# Altium project pad.PrjPCB
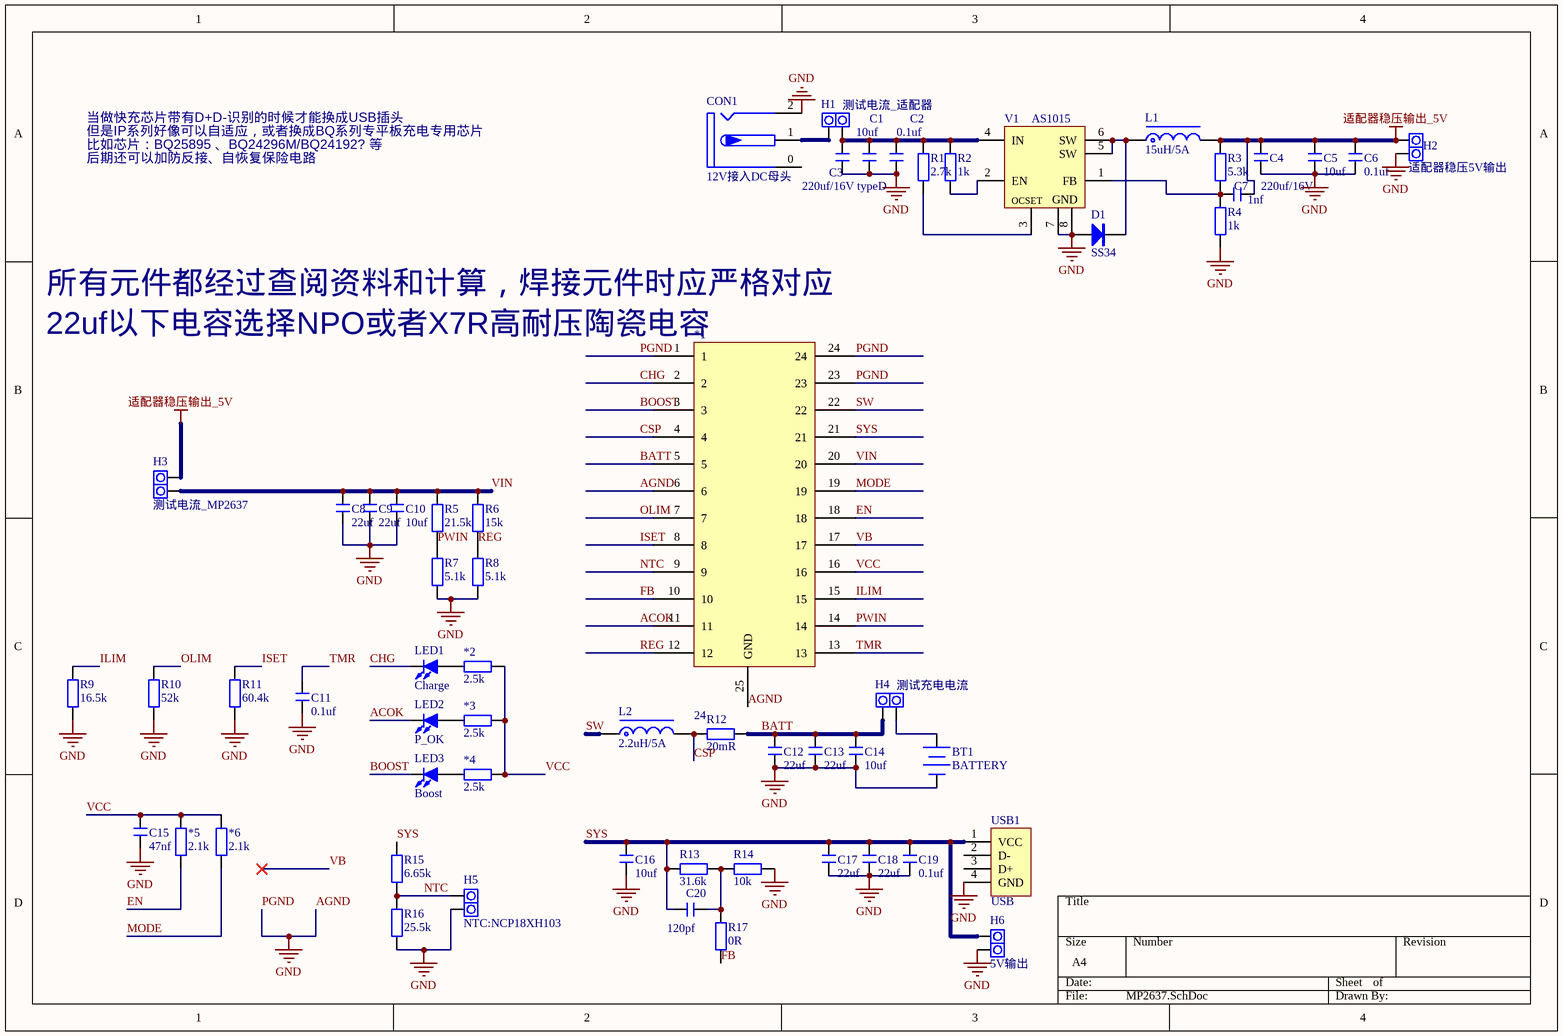
[diagram p0: MP2637.SchDoc]
3 sheets, 108 parts. Net scope: global (net labels, ports and power ports of the same name join across sheets).
Board file: pad_power.PcbDoc
Sheets:
  MP2637.SchDoc
  无线接收端.SchDoc
  12V适配器部分_无线发射端.SchDoc

## Sheet MP2637.SchDoc
size A4

### Parts
*1  24  [QFN24 4x4_M]
*2  2.5k  [R 0805_M]
*3  2.5k  [R 0805_M]
*4  2.5k  [R 0805_M]
*5  2.1k  [R 0805_M]
*6  2.1k  [R 0805_M]
BT1  BATTERY  [BAT-2]
C1  10uf  [C 0805_M]
C2  0.1uf  [C 0805_M]
C3  220uf/16V typeD  [CD D(7343)]
C4  220uf/16V  [CD D(7343)]
C5  10uf  [C 0805_M]
C6  0.1uf  [C 0805_M]
C7  1nf  [C 0805_M]
C8  22uf  [C 0805_M]
C9  22uf  [C 0805_M]
C10  10uf  [C 0805_M]
C11  0.1uf  [C 0805_M]
C12  22uf  [C 0805_M]
C13  22uf  [C 0805_M]
C14  10uf  [C 0805_M]
C15  47nf  [C 0805_M]
C16  10uf  [C 0805_M]
C17  22uf  [C 0805_M]
C18  22uf  [C 0805_M]
C19  0.1uf  [C 0805_M]
C20  120pf  [C 0805_M]
CON1  12V接入DC母头  [DC-005P]
D1  SS34  [SMA]
H1  测试电流_适配器  [PAD2-2.54]
H2  适配器稳压5V输出  [PAD2-2.54]
H3  测试电流_MP2637  [PAD2-2.54]
H4  测试充电电流  [PAD2-2.54]
H5  NTC:NCP18XH103  [PAD2-2.54]
H6  5V输出  [PAD2-2.54]
L1  15uH/5A  [L-SMD-0630]
L2  2.2uH/5A  [L-SMD-0630]
LED1  Charge  [LED 0805G]
LED2  P_OK  [LED 0805G]
LED3  Boost  [LED 0805G]
R1  2.7k  [R 0805_M]
R2  1k  [R 0805_M]
R3  5.3k  [R 0805_M]
R4  1k  [R 0805_M]
R5  21.5k  [R 0805_M]
R6  15k  [R 0805_M]
R7  5.1k  [R 0805_M]
R8  5.1k  [R 0805_M]
R9  16.5k  [R 0805_M]
R10  52k  [R 0805_M]
R11  60.4k  [R 0805_M]
R12  20mR  [R 2512-HP_L]
R13  31.6k  [R 0805_M]
R14  10k  [R 0805_M]
R15  6.65k  [R 0805_M]
R16  25.5k  [R 0805_M]
R17  0R  [R 0805_M]
USB1  USB  [USB-A/S_A]
V1  AS1015  [SOP8_N]

### Nets
AGND: *1.1 *1.6 *1.23 *1.24 *1.25(GND) BT1.2(-) C1.1 C2.1 C3.1 C4.1 C5.1 C6.1 C8.1 C9.1 C10.1 C11.1 C12.1 C13.1 C14.1 C15.1 C16.1 C17.1 C18.1 C19.1 CON1.2 D1.1(A) H2.2 H5.2 H6.2 R4.2 R7.2 R8.2 R9.2 R10.1 R11.1 R14.2 R16.2 USB1.4(GND) V1.7(GND) V1.8(GND)  [also labelled GND, PGND]
适配器稳压输出_5V: C4.2 C5.2 C6.2 C7.1 H2.1 H3.2 L1.2 R3.1
ACOK: *1.11 LED2.2(K)
BATT: *1.5 C12.2 C13.2 C14.2 H4.1 R12.2
BOOST: *1.3 LED3.2(K)
CHG: *1.2 LED1.2(K)
CSP: *1.4 L2.2 R12.1
EN: *1.18 *5.2
FB: *1.10 R17.1
ILIM: *1.15 R9.1
ISET: *1.8 R11.2
MODE: *1.19 *6.2
NTC: *1.9 H5.1 R15.2 R16.1
OLIM: *1.7 R10.2
PWIN: *1.14 R5.2 R7.1
REG: *1.12 R6.2 R8.1
SW: *1.22 L2.1
SYS: *1.21 C16.2 C17.2 C18.2 C19.2 C20.1 H6.1 R13.1 R15.1 USB1.1(VCC)
TMR: *1.13 C11.2
VB: *1.17
VCC: *1.16 *2.2 *3.2 *4.2 *5.1 *6.1 C15.2
VIN: *1.20 C8.2 C9.2 C10.2 H3.1 R5.1 R6.1
Net*2_1: *2.1 LED1.1(A)
Net*3_1: *3.1 LED2.1(A)
Net*4_1: *4.1 LED3.1(A)
NetBT1_1: BT1.1(+) H4.2
NetC1_2: C1.2 C2.2 C3.2 H1.2 R1.1 R2.1 V1.4(IN)
NetC7_2: C7.2 R3.2 R4.1 V1.1(FB)
NetC20_2: C20.2 R13.2 R14.1 R17.2
NetCON1_1: CON1.1 H1.1
NetD1_2: D1.2(K) L1.1 V1.5(SW) V1.6(SW)
NetR1_2: R1.2 V1.3(OCSET)
NetR2_2: R2.2 V1.2(EN)

Not connected (* = marked no-connect by the designer): CON1 0; USB1 2(D-) 3(D+)

### Notes on the sheet
- 当做快充芯片带有D+D-识别的时候才能换成USB插头
- 但是IP系列好像可以自适应，或者换成BQ系列专平板充电专用芯片
- 比如芯片：BQ25895 、BQ24296M/BQ24192? 等
- 后期还可以加防反接、自恢复保险电路
- 所有元件都经过查阅资料和计算，焊接元件时应严格对应
- 22uf以下电容选择NPO或者X7R高耐压陶瓷电容

### Library data of the parts
*2-*6 R1-R17 = R: 贴片电阻; 版权归属: 源创客; BOM名称: 贴片电阻; 学习资源: www.ooocke.com
BT1 = BATTERY: Multicell Battery; Published: 24-Mar-1999; LatestRevisionDate: 17-Jul-2002; LatestRevisionNote: Re-released for DXP Platform.; PackageReference: BAT-2; Publisher: Altium Limited
C1-C20 = C: 无极性贴片电容; 版权归属: 源创客; BOM名称: 无极性贴片电容; 学习资源: www.ooocke.com
CON1 = DC-005P: 带屏蔽DC电源接口; 版权归属: 源创客; BOM名称: 带屏蔽DC电源接口; 学习资源: www.ooocke.com
D1 = SS34: 肖特基二极管; 版权归属: 源创客; 属性: 40V/3A; BOM名称: 肖特基二极管; 学习资源: www.ooocke.com
H1-H6 = PAD2: 引线焊盘; 版权归属: 源创客; BOM名称: 引线焊盘; 学习资源: www.ooocke.com
L1 L2 = L-CDRH: 功率屏蔽电感; 版权归属: 源创客; BOM名称: 功率屏蔽电感; 学习资源: www.ooocke.com
LED1-LED3 = LED-SMD: 贴片LED; 版权归属: 源创客; BOM名称: 贴片LED; 学习资源: www.ooocke.com
USB1 = USB-A/S: USB-A型母接口; 版权归属: 源创客; BOM名称: USB-A型母接口; 学习资源: www.ooocke.com
V1 = AS1015: 可调升压芯片; 版权归属: 源创客; BOM名称: 可调升压芯片; 学习资源: www.ooocke.com

## Sheet 无线接收端.SchDoc
size A4
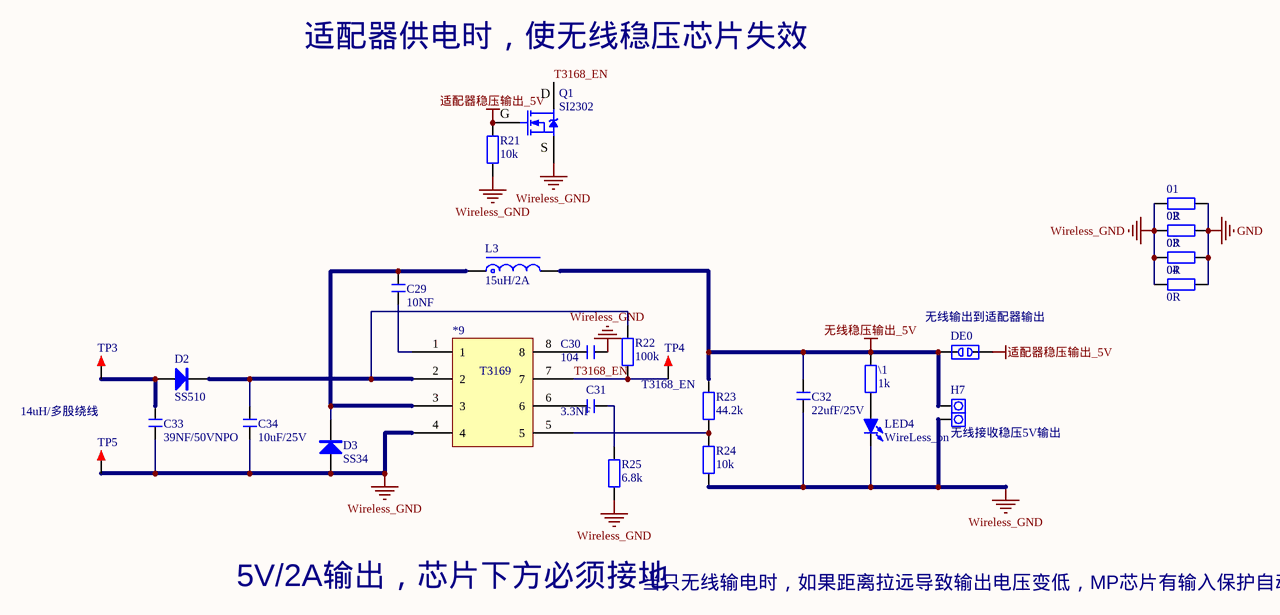
[diagram p1: 无线接收端.SchDoc]

### Parts
01  0R  [R 0805_M]
02  0R  [R 0805_M]
03  0R  [R 0805_M]
04  0R  [R 0805_M]
*9  T3169  [SOP8_M]
\1  1k  [R 0805_M]
C29  10NF  [C 0805_M]
C30  104  [C 0805_M]
C31  3.3NF  [C 0805_M]
C32  22ufF/25V  [C 0805_M]
C33  39NF/50VNPO  [C 0805_M]
C34  10uF/25V  [C 0805_M]
D2  SS510  [SMC]
D3  SS34  [SMA]
DE0  无线输出到适配器输出  [DEBUG_B]
H7  无线接收稳压5V输出  [PAD2-2.54]
L3  15uH/2A  [L-SMD-0630]
LED4  WireLess_on  [LED 0805G]
Q1  SI2302  [SOT23-3N]
R21  10k  [R 0805_M]
R22  100k  [R 0805_M]
R23  44.2k  [R 0805_M]
R24  10k  [R 0805_M]
R25  6.8k  [R 0805_M]
TP3  14uH/多股绕线  [TEST 2.0]
TP4  T3168_EN  [TEST 1]
TP5  14uH/多股绕线  [TEST 2.0]  (value not drawn)

### Nets
GND: 01.2 02.2 03.2 04.2  [project net AGND]
Wireless_GND: 01.1 02.1 03.1 04.1 *9.4 C30.1 C32.1 C33.1 C34.1 D3.1(A) H7.2 LED4.2(K) Q1.2(S) R21.2 R24.2 R25.1 TP5.1
无线稳压输出_5V: \1.2 C32.2 DE0.1 H7.1 L3.2 R23.1
适配器稳压输出_5V: DE0.2 Q1.1(G) R21.1
T3168_EN: *9.7 Q1.3(D) R22.1 TP4.1
Net*9_1: *9.1 C29.2
Net*9_2: *9.2 C34.2 D2.2(K) R22.2
Net*9_3: *9.3 C29.1 D3.2(K) L3.1
Net*9_5: *9.5 R23.2 R24.1
Net*9_6: *9.6 C31.2
Net*9_8: *9.8 C30.2
Ne~{t}1_1: \1.1 LED4.1(A)
NetC31_1: C31.1 R25.2
NetC33_2: C33.2 D2.1(A) TP3.1

### Notes on the sheet
- 适配器供电时，使无线稳压芯片失效
- 5V/2A输出，芯片下方必须接地
- 当只无线输电时，如果距离拉远导致输出电压变低，MP芯片有输入保护自动切换成电池升压输出模式

### Library data of the parts
01 02 03 04 \1 R21-R25 = R: 贴片电阻; 版权归属: 源创客; BOM名称: 贴片电阻; 学习资源: www.ooocke.com
*9 = 8
C29-C34 = C: 无极性贴片电容; 版权归属: 源创客; BOM名称: 无极性贴片电容; 学习资源: www.ooocke.com
D2 D3 = SS34: 肖特基二极管; 版权归属: 源创客; 属性: 40V/3A; BOM名称: 肖特基二极管; 学习资源: www.ooocke.com
DE0 = DEBUG: 调试断点焊盘; 版权归属: 源创客; BOM名称: 调试断点焊盘; 学习资源: www.ooocke.com
H7 = PAD2: 引线焊盘; 版权归属: 源创客; BOM名称: 引线焊盘; 学习资源: www.ooocke.com
L3 = L-CDRH: 功率屏蔽电感; 版权归属: 源创客; BOM名称: 功率屏蔽电感; 学习资源: www.ooocke.com
LED4 = LED-SMD: 贴片LED; 版权归属: 源创客; BOM名称: 贴片LED; 学习资源: www.ooocke.com
Q1 = SI2302: N沟道场效应管; 版权归属: 源创客; BOM名称: N沟道场效应管; 学习资源: www.ooocke.com
TP3-TP5 = TEST: 测试点; 版权归属: 源创客; BOM名称: 测试点; 学习资源: www.ooocke.com

## Sheet 12V适配器部分_无线发射端.SchDoc
size A4
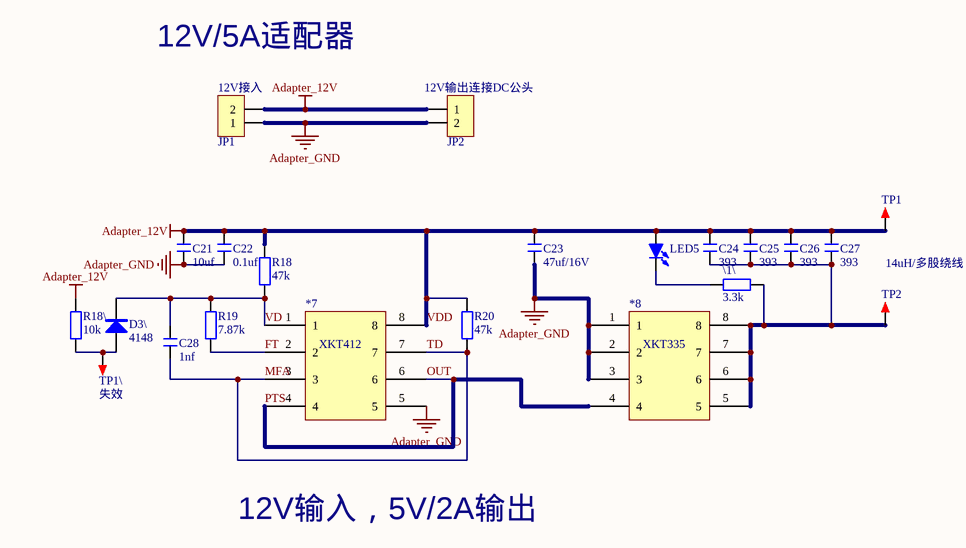
[diagram p2: 12V适配器部分_无线发射端.SchDoc]

### Parts
*7  XKT412  [SOP8_M]
*8  XKT335  [SOP8_M]
\1\  3.3k  [R 0805_M]
C21  10uf  [C 0805_M]
C22  0.1uf  [C 0805_M]
C23  47uf/16V  [C 1206_L]
C24  393  [C 0805_M]
C25  393  [C 0805_M]
C26  393  [C 0805_M]
C27  393  [C 0805_M]
C28  1nf  [C 0805_M]
D3\  4148  [SOD-123F]
JP1  12V接入  [KF301-5.0-2P]
JP2  12V输出连接DC公头  [KF301-5.0-2P]
LED5  WireLess_on  [LED 0805G]  (value not drawn)
R18  47k  [R 0805_M]
R18\  10k  [R 0805_M]
R19  7.87k  [R 0805_M]
R20  47k  [R 0805_M]
TP1  14uH/多股绕线  [TEST 2.0]
TP1\  失效  [TEST 2.0]
TP2  14uH/多股绕线  [TEST 2.0]  (value not drawn)

### Nets
Adapter_GND: *7.5 *8.1 *8.2 *8.3 C21.1 C22.1 C23.1 JP1.1 JP2.2
VDD: *7.8 C21.2 C22.2 C23.2 C24.2 C25.2 C26.2 C27.2 JP1.2 JP2.1 LED5.1(A) R18.1 R18\.1 R20.1 TP1.1  [also labelled Adapter_12V]
FT: *7.2 R19.2
MFA: *7.3 *7.7 C28.1 R20.2  [also labelled TD]
OUT: *7.4 *7.6 *8.4  [also labelled PTS]
VD: *7.1 C28.2 D3\.2(K) R18.2 R19.1
Net*8_5: *8.5 *8.6 *8.7 *8.8 \1\.1 C24.1 C25.1 C26.1 C27.1 TP2.1
Ne~{t1}_2: \1\.2 LED5.2(K)
NetD~{3}_1: D3\.1(A) R18\.2 TP1\.1

### Notes on the sheet
- 12V/5A适配器
- 12V输入，5V/2A输出

### Library data of the parts
*7 *8 = 8
\1\ R18 R18\ R19 R20 = R: 贴片电阻; 版权归属: 源创客; BOM名称: 贴片电阻; 学习资源: www.ooocke.com
C21-C28 = C: 无极性贴片电容; 版权归属: 源创客; BOM名称: 无极性贴片电容; 学习资源: www.ooocke.com
D3\ = SS34: 肖特基二极管; 版权归属: 源创客; 属性: 40V/3A; BOM名称: 肖特基二极管; 学习资源: www.ooocke.com
JP1 JP2 = Header 2: 2P接插件; 版权归属: 源创客; BOM名称: 2P接插件; 学习资源: www.ooocke.com
LED5 = LED-SMD: 贴片LED; 版权归属: 源创客; BOM名称: 贴片LED; 学习资源: www.ooocke.com
TP1 TP1\ TP2 = TEST: 测试点; 版权归属: 源创客; BOM名称: 测试点; 学习资源: www.ooocke.com

## Nets that join several sheets
AGND: MP2637 (40 pins), 无线接收端 (01.2 02.2 03.2 04.2)
适配器稳压输出_5V: MP2637 (8 pins), 无线接收端 (DE0.2 Q1.1 R21.1)